# Altium project Kovtonogov.PrjPcb
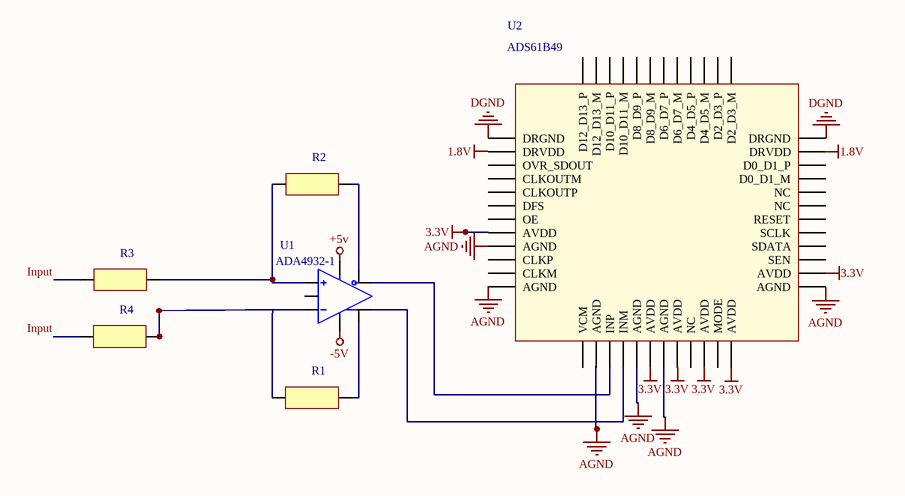
[diagram p0: Sheet1.SchDoc]
1 sheet, 6 parts. Net scope: global (net labels, ports and power ports of the same name join across sheets).
Board file: PCB1.PcbDoc

## Sheet Sheet1.SchDoc
size A4

### Parts
R1  (no value)  [0805]
R2  (no value)  [0805]
R3  (no value)  [0805]
R4  (no value)  [0805]
U1  ADA4932-1  [ADA4932-1]
U2  ADS61B49  [ADS61B49]

### Nets
3.3V: U2.20(AVDD) U2.22(AVDD) U2.24(AVDD) U2.26(AVDD)
+5v: U1.13
-5V: U1.5
AGND: U2.9(AGND) U2.12(AGND) U2.14(AGND) U2.17(AGND) U2.19(AGND) U2.25(AGND)
DGND: U2.36(DRGND)
Input: R3.2 R4.2
NetR1_1: R1.1 U1.4
NetR1_2: R1.2 R4.1 U1.3
NetR2_1: R2.1 U1.1
NetR2_2: R2.2 R3.1 U1.2
NetU1_10: U1.10 U2.16(INM)
NetU1_11: U1.11 U2.15(INP)

Not connected (* = marked no-connect by the designer): U1 9(6); U2 1,49(DRGND) 2(DRVDD) 3(OVR_SDOUT) 4(CLKOUTM) 5(CLKOUTP) 6(DFS) 7(OE) 8(AVDD) 10(CLKP) 11(CLKM) 13(VCM) 18(AVDD) 21(NC) 23(MODE) 27(SEN) 28(SDATA) 29(SCLK) 30(RESET) 31(NC) 32(NC) 33(D0_D1_M) 34(D0_D1_P) 35(DRVDD) 37(D2_D3_M) 38(D2_D3_P) 39(D4_D5_M) 40(D4_D5_P) 41(D6_D7_M) 42(D6_D7_P) 43(D8_D9_M) 44(D8_D9_P) 45(D10_D11_M) 46(D10_D11_P) 47(D12_D13_M) 48(D12_D13_P)

### Notes on the sheet
- Labels drawn without touching a wire or pin: 1.8V, 3.3V, DGND

### Library data of the parts
R1-R4 = Resistor
U1 = ADA4932-1: pin to pad: 5>5+6+7+8 13>13+14+15+16